# EAGLE design gameboypocket (EAGLE 9.2.2)
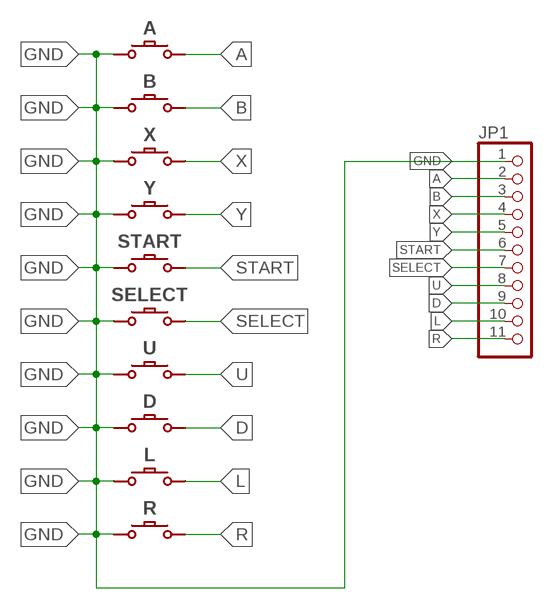
[diagram p0: schematic, sheet 1]

## Parts
A  CONDUCTIVE_BUTTON  [CONDUCTIVE_BUTTON]
B  CONDUCTIVE_BUTTON  [CONDUCTIVE_BUTTON]
D  CONDUCTIVE_BUTTON  [CONDUCTIVE_BUTTON]
JP1  PINHD-1X11  [1X11]
L  CONDUCTIVE_BUTTON  [CONDUCTIVE_BUTTON]
R  CONDUCTIVE_BUTTON  [CONDUCTIVE_BUTTON]
SELECT  CONDUCTIVE_BUTTON_STARTSELECT  [CONDUCTIVE_BUTTON_STARTSELECT]
START  CONDUCTIVE_BUTTON_STARTSELECT  [CONDUCTIVE_BUTTON_STARTSELECT]
U  CONDUCTIVE_BUTTON  [CONDUCTIVE_BUTTON]
X  CONDUCTIVE_BUTTON_DRILL  [CONDUCTIVE_BUTTON_DRILL]
Y  CONDUCTIVE_BUTTON_DRILL  [CONDUCTIVE_BUTTON_DRILL]

## Nets
A: A.P$ACTIVE JP1.2
B: B.P$ACTIVE JP1.3
D: D.P$ACTIVE JP1.9
GND: A.P$GND B.P$GND D.P$GND JP1.1 L.P$GND R.P$GND SELECT.P$GND START.P$GND U.P$GND X.P$GND Y.P$GND
L: JP1.10 L.P$ACTIVE
R: JP1.11 R.P$ACTIVE
SELECT: JP1.7 SELECT.P$ACTIVE
START: JP1.6 START.P$ACTIVE
U: JP1.8 U.P$ACTIVE
X: JP1.4 X.P$ACTIVE
Y: JP1.5 Y.P$ACTIVE

## Library data of the parts
A B D L R U = 32teeth - Conductive Buttons:CONDUCTIVE_BUTTON
JP1 = pinhead:PINHD-1X11: PIN HEADER
SELECT START = 32teeth - Conductive Buttons:CONDUCTIVE_BUTTON_STARTSELECT
X Y = 32teeth - Conductive Buttons:CONDUCTIVE_BUTTON_DRILL

## Board
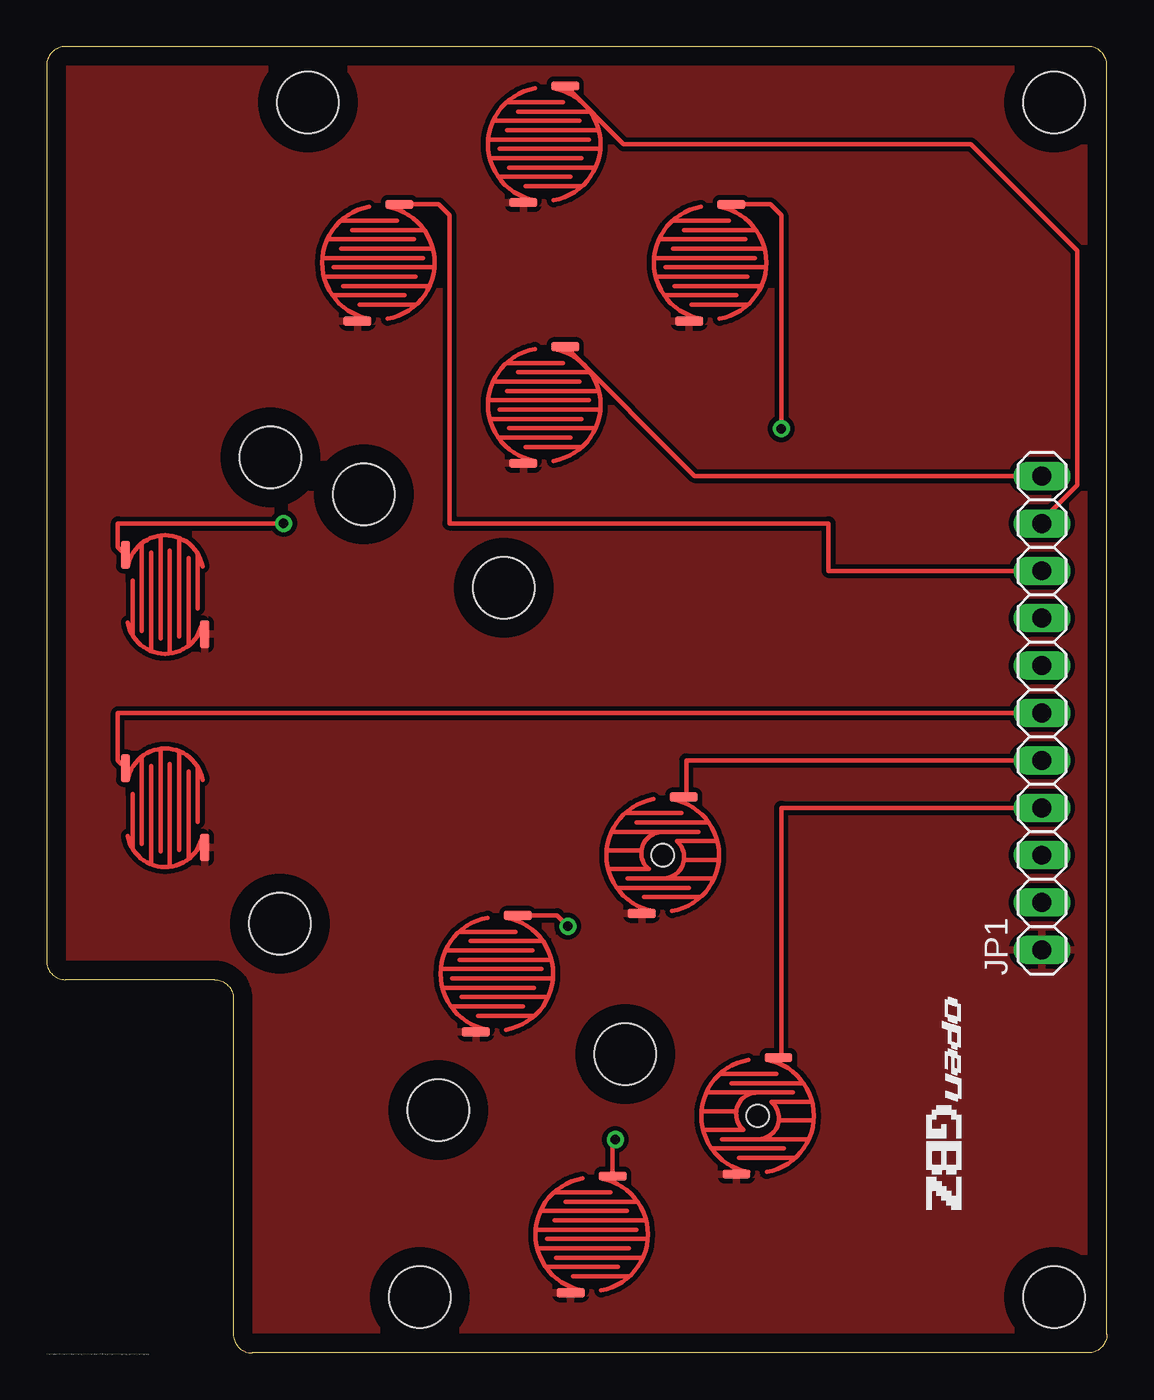
[diagram p1: board, top side]
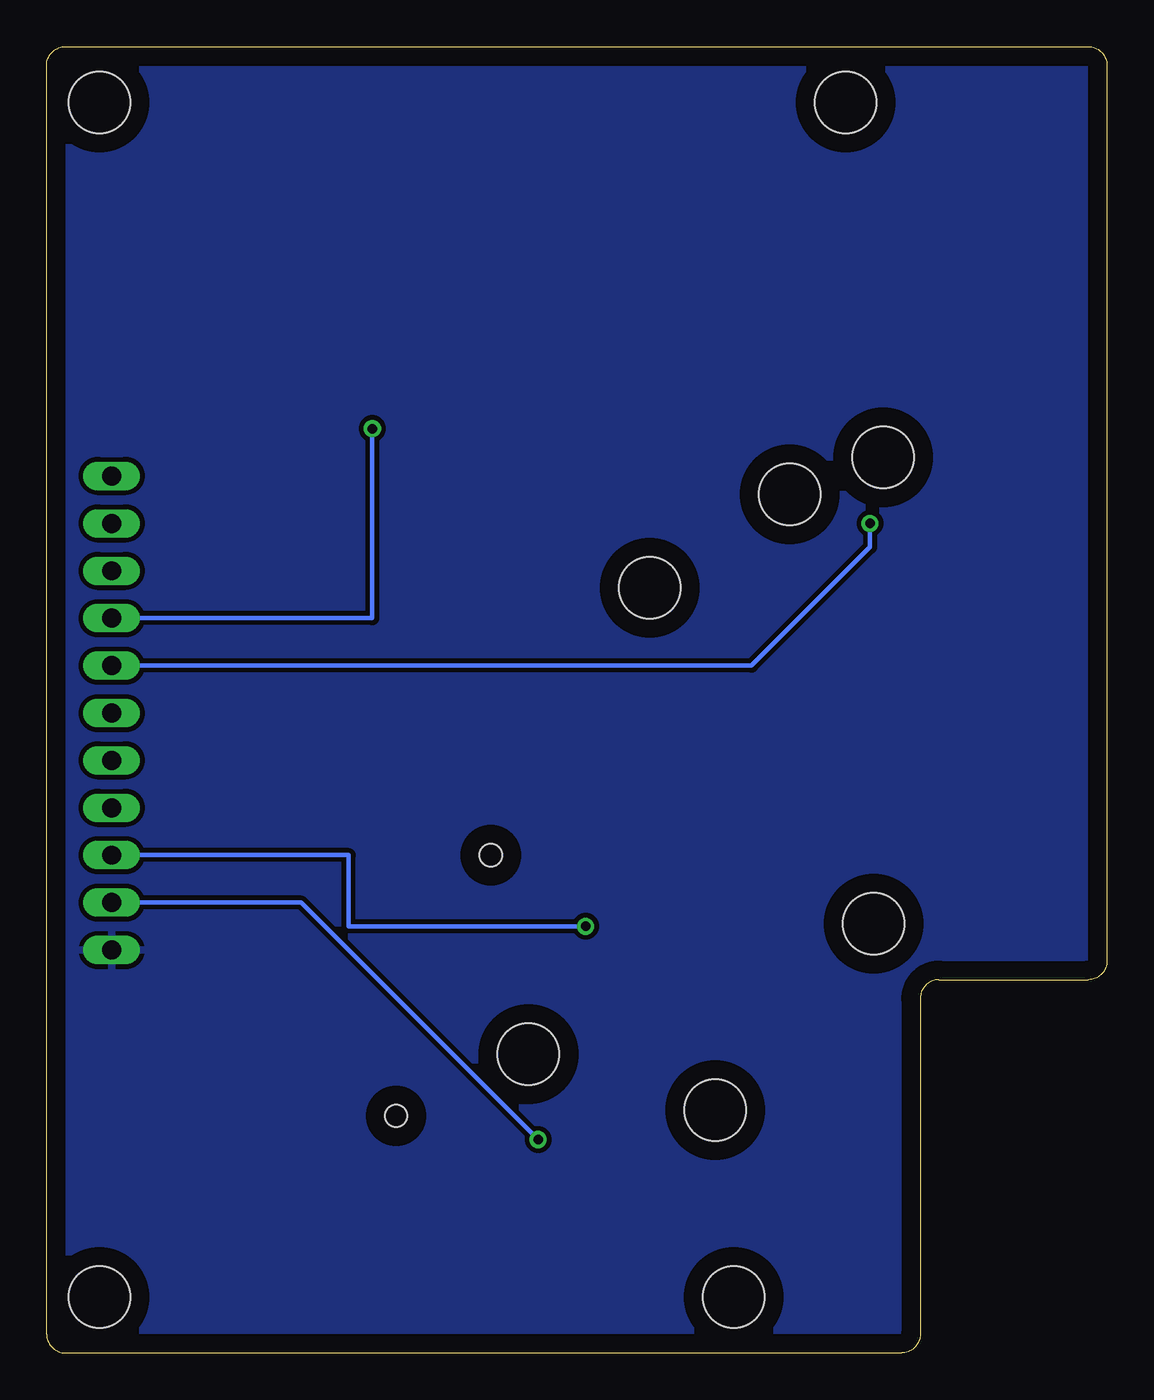
[diagram p2: board, bottom side, seen from below]

Size 56.83 x 70 mm. Coordinates in mm from the lower left corner, seen from the top.
Outline: 10,19 10,1 arc90 11,0 55.83,0 arc90 56.83,1 56.83,69 arc90 55.83,70 1,70 arc90 0,69 0,21 arc90 1,20 9,20 arc-90 10,19
Copper layers (1*16): Top 0.035mm / dielectric 1.5mm / Bottom 0.035mm
Design rules "default *": minimum track width 10mil, minimum drill 20mil, track to track 10mil, track to pad 10mil, pad to pad 10mil, via to via 10mil, smd to smd 10mil, copper to edge 40mil, drill to drill 20mil, minimum pad ring 10mil, minimum via ring 8mil, stop-mask expansion 4mil, vias tented up to drill 20mil, thermal gap 10mil

### Footprints (pad centres in the part's own frame; a part is rotated, then mirrored left to right if it is on the bottom)
CONDUCTIVE_BUTTON = smd 1.5 x 0.508: P$ACTIVE 1.125,3.125; P$GND -1.125,-3.125
1X11 = drill 1.016 long: 1 -12.7,0; 2 -10.16,0; 3 -7.62,0; 4 -5.08,0; 5 -2.54,0; 6 0,0; 7 2.54,0; 8 5.08,0; 9 7.62,0; 10 10.16,0; 11 12.7,0
CONDUCTIVE_BUTTON_STARTSELECT = smd 1.5 x 0.508: P$ACTIVE 2.125,2.125; P$GND -2.125,-2.125
STAND-OFF = hole 3.302: 0,0
CONDUCTIVE_BUTTON_DRILL = smd 1.5 x 0.508: P$ACTIVE 1.125,3.125; P$GND -1.125,-3.125 | hole 1.2: 0,0

### Placement (x,y rotation side)
A  29.21,6.35 0 top
B  24.13,20.32 0 top
D  17.78,58.42 0 top
JP1  53.34,34.29 90 top
L  26.67,64.77 0 top
R  26.67,50.8 0 top
SELECT  6.35,40.64 90 top
START  6.35,29.21 90 top
U  35.56,58.42 0 top
U$3  [STAND-OFF]  14,67 0 top
U$4  [STAND-OFF]  12.5,23 0 top
U$5  [STAND-OFF]  20,3 0 top
U$6  [STAND-OFF]  24.5,41 0 top
U$7  [STAND-OFF]  17,46 0 top
U$8  [STAND-OFF]  54,67 0 top
U$9  [STAND-OFF]  21,13 0 top
U$10  [STAND-OFF]  12,48 0 top
U$11  [STAND-OFF]  31,16 0 top
U$12  [STAND-OFF]  54,3 0 top
X  38.1,12.7 0 top
Y  33.02,26.67 0 top

### Tracks (layer width: path | path; a pad name or v marks a point on that pad's centre or on a via)
A  (via drill 0.51)
  Top 0.254: A.P$ACTIVE 30.34,11.29 v30.48,11.43
  Bottom 0.254: v30.48,11.43 43.18,24.13 JP1.2
B  (via drill 0.51)
  Top 0.254: B.P$ACTIVE 27.36,23.45 v27.94,22.86
  Bottom 0.254: v27.94,22.86 40.64,22.86 40.64,26.67 JP1.3
D
  Top 0.254: D.P$ACTIVE 21,61.55 21.59,60.96 21.59,44.45 41.91,44.45 41.91,41.91 JP1.9
GND
  pour Top: 0,70 0,20 10,20 10,0 56.83,0 56.83,70
  pour Bottom: 0,70 56.83,70 56.83,0 10,0 10,20 0,20
L
  Top 0.254: L.P$ACTIVE 30.92,64.77 49.53,64.77 55.24,59.05 55.24,46.52 53.34,44.61 JP1.10
R
  Top 0.254: R.P$ACTIVE 34.73,46.99 JP1.11
SELECT  (via drill 0.51)
  Top 0.254: SELECT.P$ACTIVE 3.81,43.18 3.81,44.45 v12.7,44.45
  Bottom 0.254: v12.7,44.45 12.7,43.18 19.05,36.83 JP1.7
START
  Top 0.254: START.P$ACTIVE 3.81,31.75 3.81,34.29 JP1.6
U  (via drill 0.51)
  Top 0.254: U.P$ACTIVE 38.78,61.55 39.37,60.96 v39.37,49.53
  Bottom 0.254: v39.37,49.53 39.37,39.37 JP1.8
X
  Top 0.254: X.P$ACTIVE 39.37,15.97 39.37,29.21 JP1.4
Y
  Top 0.254: Y.P$ACTIVE 34.29,29.94 34.29,31.75 JP1.5

### Text on the board
tNames: C:/Users/Admin/Documents/GitHub/Gameboy-Zero-Pocket-Button-PCB/images/OpenGBZ/logos/top_openGBZ_smallogo.bmp